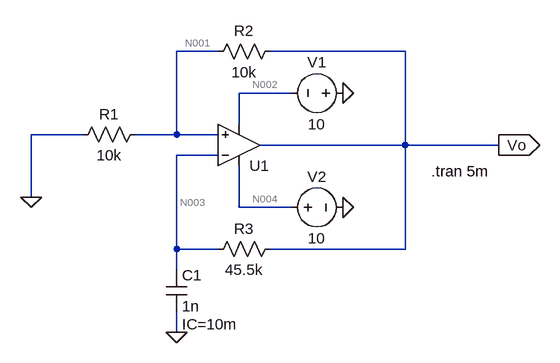
[diagram p0: schematic BP3.asc]
BP3.asc, the LTspice schematic file:
Version 4.1
SHEET 1 880 680
WIRE 176 16 112 16
WIRE 464 16 256 16
WIRE 288 80 208 80
WIRE 208 128 208 80
WIRE -32 144 -112 144
WIRE 112 144 112 16
WIRE 112 144 48 144
WIRE 176 144 112 144
WIRE 464 160 464 16
WIRE 464 160 240 160
WIRE 608 160 464 160
WIRE 176 176 112 176
WIRE -112 240 -112 144
WIRE 208 256 208 192
WIRE 288 256 208 256
WIRE 112 320 112 176
WIRE 176 320 112 320
WIRE 464 320 464 160
WIRE 464 320 256 320
WIRE 112 352 112 320
WIRE 112 448 112 416
FLAG 368 80 0
FLAG 368 256 0
FLAG 608 160 Vo
IOPIN 608 160 Out
FLAG 112 448 0
FLAG -112 240 0
SYMBOL OpAmps\\UniversalOpAmp2 208 160 M180
SYMATTR InstName U1
SYMBOL res 64 128 R90
WINDOW 0 0 56 VBottom 2
WINDOW 3 32 56 VTop 2
SYMATTR InstName R1
SYMATTR Value 10k
SYMBOL res 272 0 R90
WINDOW 0 0 56 VBottom 2
WINDOW 3 32 56 VTop 2
SYMATTR InstName R2
SYMATTR Value 10k
SYMBOL res 272 304 R90
WINDOW 0 0 56 VBottom 2
WINDOW 3 32 56 VTop 2
SYMATTR InstName R3
SYMATTR Value 45.5k
SYMBOL cap 96 352 R0
WINDOW 39 24 84 Left 2
SYMATTR InstName C1
SYMATTR Value 1n
SYMATTR SpiceLine IC=10m
SYMBOL voltage 384 80 R90
WINDOW 0 -32 56 VBottom 2
WINDOW 3 32 56 VTop 2
WINDOW 123 0 0 Left 0
WINDOW 39 0 0 Left 0
SYMATTR InstName V1
SYMATTR Value 10
SYMBOL voltage 272 256 R270
WINDOW 0 32 56 VTop 2
WINDOW 3 -32 56 VBottom 2
WINDOW 123 0 0 Left 0
WINDOW 39 0 0 Left 0
SYMATTR InstName V2
SYMATTR Value 10
TEXT 504 200 Left 2 !.tran 5m

The netlist it stands for:
* BP3.asc
X§U1 N001 N003 N004 N002 Vo level2 Avol=1Meg GBW=10Meg Slew=10Meg Ilimit=25m Rail=0 Vos=0 En=0 Enk=0 In=0 Ink=0 Rin=500Meg  ; pins In+ In- V+ V- OUT
R1 N001 0 10k
R2 Vo N001 10k
R3 Vo N003 45.5k
C1 N003 0 1n IC=10m
V1 0 N002 10
V2 N004 0 10
.tran 5m
.lib UniversalOpAmp2.lib
.backanno
.end

* Results of the author's LTspice run, read from the files saved beside the schematic
* Operating Point, zero values left out:
*   V(n001) = -4.996 V
*   V(n002) = -10 V
*   V(n003) = 10 mV
*   V(n004) = 10 V
*   V(vo) = -9.993 V
*   I(C1) = -219.8 µA
*   I(R1) = -499.6 µA
*   I(R2) = -499.6 µA
*   I(R3) = -219.8 µA
*   I(V1) = -721.5 µA
*   I(V2) = -2.258 µA
*   Ix(u1:1) = -9.992 nA
*   Ix(u1:2) = 20 pA
*   Ix(u1:3) = 2.258 µA
*   Ix(u1:4) = -721.5 µA
*   Ix(u1:5) = 719.5 µA
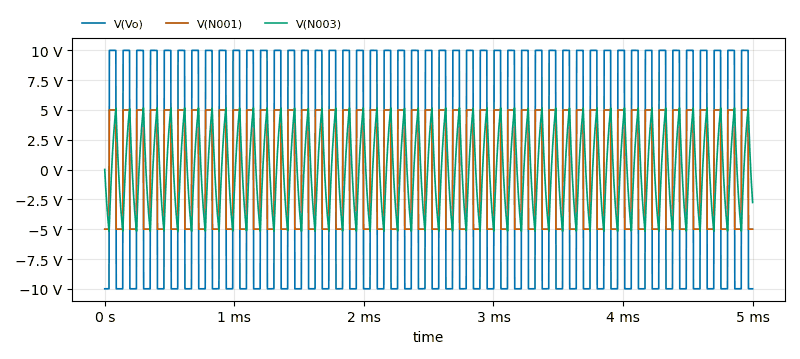
[diagram p1: Transient Analysis of BP3.asc, plotted from the saved traces]
* Transient Analysis, 1 run:
*   V(Vo): min -9.994 V, max 9.994 V, average -30.99 mV, rms 9.875 V, last -9.993 V
*   V(N001): min -4.997 V, max 4.997 V, average -15.49 mV, rms 4.937 V, last -4.997 V
*   V(N003): min -5.179 V, max 5.172 V, average -5.771 mV, rms 3.17 V, last -2.757 V